# EAGLE schematic untitled (EAGLE 6.5.0)
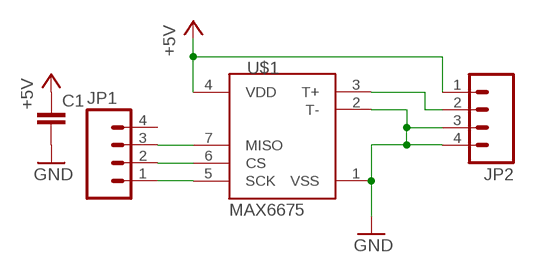
[diagram p0: schematic, sheet 1]

## Parts
C1  CAP0805  [0805]
JP1  M04LONGPADS  [1X04_LONGPADS]
JP2  M04LONGPADS  [1X04_LONGPADS]
U$1  MAX6675  [SO08-MAX6675]

## Nets
+5V: C1.1 JP2.1 U$1.4(VDD)
GND: C1.2 JP2.3 JP2.4 U$1.1(VSS) U$1.2(T-)
N$1: JP1.1 U$1.5(SCK)
N$2: JP1.3 U$1.7(MISO)
N$3: JP1.2 U$1.6(CS)
N$4: JP2.2 U$1.3(T+)
Unconnected: JP1.4

## Library data of the parts
C1 = SparkFun-Passives:CAP: Capacitor Standard 0603 ceramic capacitor, and 0.1" leaded capacitor.
JP1 JP2 = SparkFun-Connectors:M04: Header 4 Standard 4-pin 0.1" header. Use with straight break away headers (SKU : PRT-00116), right angle break away headers (PRT-00553), swiss pins (PRT-00743), machine pins (PRT-00117), and female headers (PRT-00115). Molex polarized connector foot print use with SKU : PRT-08231 with associated crimp pins and housings. 1MM SMD Version SKU: PRT-10208
U$1 = SparkFun-AnalogIC:MAX6675: K-type thermocouple ADC, SPI output